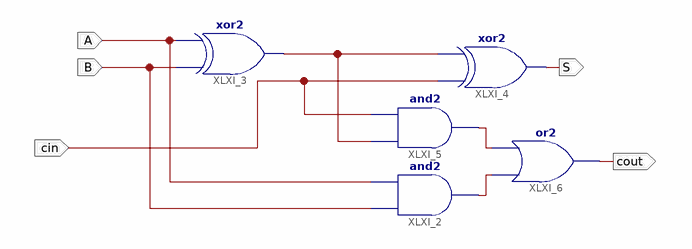
[diagram p0: schematic sheet 1]
// Xilinx ISE schematic Sumador1Bit.sch (spartan3e) as structural Verilog: 5 symbols, 5 ports
module Sumador1Bit (
  input  A,
  input  B,
  input  cin,
  output S,
  output cout
);

  wire XLXN_17, XLXN_22, XLXN_23;

  and XLXI_2 (XLXN_23, B, A);
  xor XLXI_3 (XLXN_17, B, A);
  xor XLXI_4 (S, cin, XLXN_17);
  and XLXI_5 (XLXN_22, XLXN_17, cin);
  or XLXI_6 (cout, XLXN_23, XLXN_22);
endmodule
